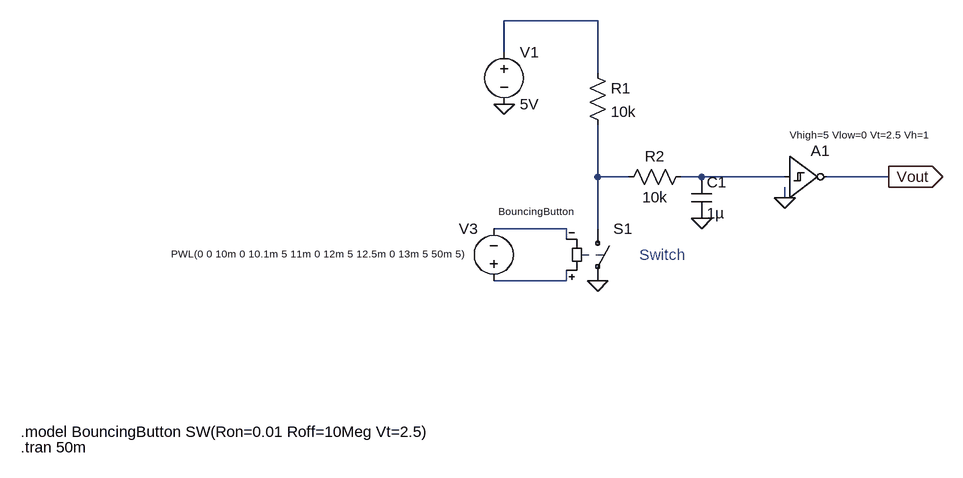
[diagram p0: schematic Analog_Debouncer.asc]
Analog_Debouncer.asc, the LTspice schematic file:
Version 4.1
SHEET 1 880 680
WIRE -64 -80 -208 -80
WIRE -208 -32 -208 -80
WIRE -64 0 -64 -80
WIRE -64 160 -64 80
WIRE -16 160 -64 160
WIRE 96 160 64 160
WIRE 224 160 96 160
WIRE 384 160 288 160
WIRE 224 192 224 176
WIRE -112 240 -224 240
WIRE -64 240 -64 160
WIRE -112 256 -112 240
WIRE -112 320 -112 304
WIRE -112 320 -224 320
FLAG -208 48 0
FLAG 96 224 0
FLAG -64 320 0
FLAG 224 192 0
FLAG 384 160 Vout
IOPIN 384 160 Out
SYMBOL Digital\\schmtinv 224 96 R0
WINDOW 3 8 -1 Left 1
SYMATTR Value Vhigh=5 Vlow=0 Vt=2.5 Vh=1
SYMATTR InstName A1
SYMBOL voltage -208 -48 R0
WINDOW 123 0 0 Left 0
WINDOW 39 0 0 Left 0
SYMATTR InstName V1
SYMATTR Value 5V
SYMBOL res -80 -16 R0
SYMATTR InstName R1
SYMATTR Value 10k
SYMBOL cap 80 160 R0
SYMATTR InstName C1
SYMATTR Value 1µ
SYMBOL res 80 144 R90
WINDOW 0 0 56 VBottom 2
WINDOW 3 32 56 VTop 2
SYMATTR InstName R2
SYMATTR Value 10k
SYMBOL sw -64 224 R0
WINDOW 3 -153 -11 Left 1
SYMATTR InstName S1
SYMATTR Value BouncingButton
SYMBOL voltage -224 336 R180
WINDOW 0 24 96 Left 2
WINDOW 3 55 58 Left 1
WINDOW 123 0 0 Left 0
WINDOW 39 0 0 Left 0
SYMATTR InstName V3
SYMATTR Value PWL(0 0 10m 0 10.1m 5 11m 0 12m 5 12.5m 0 13m 5 50m 5)
TEXT -952 552 Left 2 !.model BouncingButton SW(Ron=0.01 Roff=10Meg Vt=2.5)
TEXT -952 576 Left 2 !.tran 50m
TEXT 0 280 Left 2 ;Switch

The netlist it stands for:
* Analog_Debouncer.asc
A1 N003 0 0 0 0 Vout 0 0 SCHMITT Vhigh=5 Vlow=0 Vt=2.5 Vh=1
V1 N001 0 5V
R1 N001 N002 10k
C1 N003 0 1µ
R2 N003 N002 10k
S1 N002 0 N005 N004 BouncingButton
V3 N005 N004 PWL(0 0 10m 0 10.1m 5 11m 0 12m 5 12.5m 0 13m 5 50m 5)
.model BouncingButton SW(Ron=0.01 Roff=10Meg Vt=2.5)
.tran 50m
* Switch
.backanno
.end